# Altium schematic sheet Schematic.SchDoc
size A; SheetNumber: 1; SheetTotal: 1
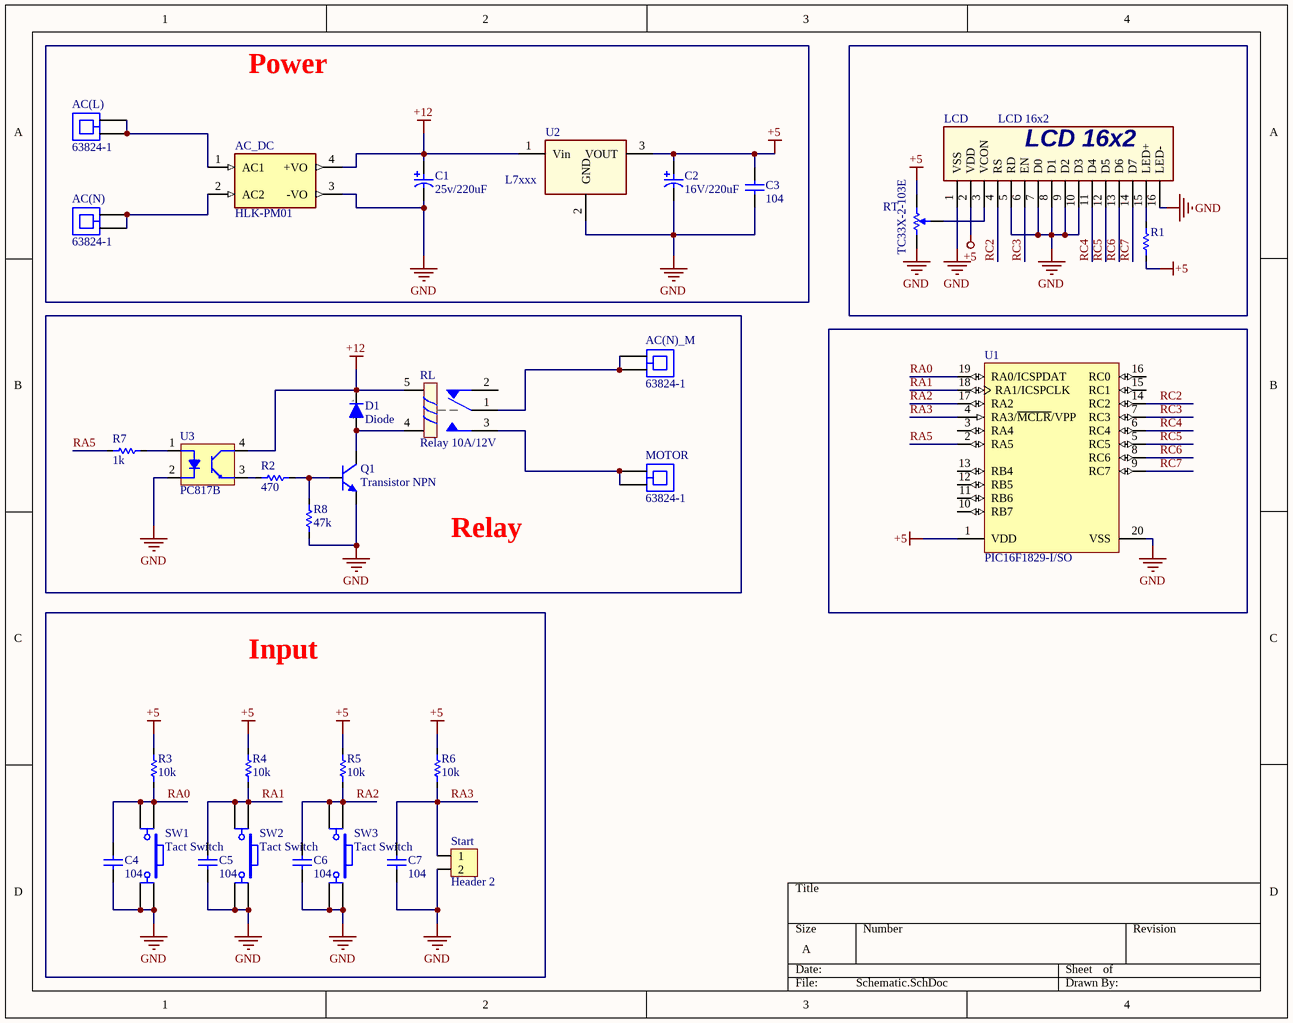
[diagram p0: Schematic.SchDoc]

## Parts
AC(L)  63824-1  [TECO-63824-1_V]
AC(N)  63824-1  [TECO-63824-1_V]
AC(N)_M  63824-1  [TECO-63824-1_V]
AC_DC  HLK-PM01  [CONV_HLK-PM01]
C1  25v/220uF  [C SMD ALU (D8)]
C2  16V/220uF  [C SMD ALU (D8)]
C3  104  [C 0805 (2012)]
C4  104  [C 0805 (2012)]
C5  104  [C 0805 (2012)]
C6  104  [C 0805 (2012)]
C7  104  [C 0805 (2012)]
D1  Diode  [SOD-80]
LCD  LCD 16x2  [LCD 16x2]
MOTOR  63824-1  [TECO-63824-1_V]
Q1  Transistor NPN  [SOT-23]
R1  470  [R 0805 (2012)]  (value not drawn)
R2  470  [R 0805 (2012)]
R3  10k  [R 0805 (2012)]
R4  10k  [R 0805 (2012)]
R5  10k  [R 0805 (2012)]
R6  10k  [R 0805 (2012)]
R7  1k  [R 0805 (2012)]
R8  47k  [R 0805 (2012)]
RL  Relay 10A/12V  [RL_SPDT_10A]
RT  TC33X-2-103E  [BOUR-TC33X-2_V]
Start  Header 2  [XH2.54-2P]
SW1  Tact Switch  [SW/4/DIP 12x12x7]
SW2  Tact Switch  [SW/4/DIP 12x12x7]
SW3  Tact Switch  [SW/4/DIP 12x12x7]
U1  PIC16F1829-I/SO  [MCHP-SOIC-SO20_N]
U2  L7xxx  [TO-252 (DPAK)]
U3  PC817B  [SOIC-4-GULLWING]

## Nets
+5: C2.1 C3.1 LCD.2(VDD) R1.1 R3.2 R4.2 R5.2 R6.2 RT.3 U1.1(VDD) U2.3(VOUT)
+12: AC_DC.4(+VO) C1.1 D1.1(Cathode) RL.5 U2.1(Vin) U3.4(C)
GND: AC_DC.3(-VO) C1.2 C2.2 C3.2 C4.2 C5.2 C6.2 C7.2 LCD.1(VSS) LCD.5(RD) LCD.7(D0) LCD.8(D1) LCD.9(D2) LCD.10(D3) LCD.16(LED-) Q1.2(E) R8.2 RT.1 Start.2 SW1.2 SW1.3 SW2.2 SW2.3 SW3.2 SW3.3 U1.20(VSS) U2.2(GND) U3.2(K)
RA0: C4.1 R3.1 SW1.1 SW1.4 U1.19(RA0/ICSPDAT)
RA1: C5.1 R4.1 SW2.1 SW2.4 U1.18(RA1/ICSPCLK)
RA2: C6.1 R5.1 SW3.1 SW3.4 U1.17(RA2)
RA3: C7.1 R6.1 Start.1 U1.4(RA3/~{MCLR}/VPP)
RA5: R7.2 U1.2(RA5)
RC2: LCD.4(RS) U1.14(RC2)
RC3: LCD.6(EN) U1.7(RC3)
RC4: LCD.11(D4) U1.6(RC4)
RC5: LCD.12(D5) U1.5(RC5)
RC6: LCD.13(D6) U1.8(RC6)
RC7: LCD.14(D7) U1.9(RC7)
NetAC(L)_1: AC(L).1 AC(L).2 AC_DC.1(AC1)
NetAC(N)_1: AC(N).1 AC(N).2 AC_DC.2(AC2)
NetAC(N)_M_1: AC(N)_M.1 AC(N)_M.2 RL.1
NetD1_2: D1.2(Anode) Q1.3(C) RL.4
NetLCD_3: LCD.3(VCON) RT.2
NetLCD_15: LCD.15(LED+) R1.2
NetMOTOR_1: MOTOR.1 MOTOR.2 RL.3
NetQ1_1: Q1.1(B) R2.1 R8.1
NetR2_2: R2.2 U3.3(E)
NetR7_1: R7.1 U3.1(A)

Not connected (* = marked no-connect by the designer): RL 2; U1 3(RA4) 10(RB7) 11(RB6) 12(RB5) 13(RB4) 15(RC1) 16(RC0)

## Notes on the sheet
- Power
- Relay
- Input
- (in symbol Diode) k; a

## Library data of the parts
AC(L) AC(N) AC(N)_M MOTOR = CMP-1684-00002-4: Printed Circuit Board Terminal and Disconnect, 2-Pin THD, RoHS, Tape and Reel; Manufacturer: TE Connectivity; Colour: Silver; Contact Material: Brass; ComponentLink2URL: http://www.te.com/commerce/DocumentDelivery/DDEController?Action=showdoc&DocId=Customer+Drawing%7F63824%7FR%7Fpdf%7FEnglish%7FENG_CD_63824_R_baseFilename.pdf%7F63824-1; ComponentLink1URL: http://www.te.com/; Mounting Technology: Through Hole; Length: 13.63 mm; RoHSCompliant: True; ComponentLink1Description: Manufacturer URL; PackageReference: 63824-1; PackageDescription: 2-Pin Through Hole Device, Body 7.92 x 3.08 mm, Pitch 5.08 mm; Package Quantity: 10000; REACH SVHC: Unknown; ComponentLink2Description: Datasheet; DatasheetVersion: Rev. R, 06/2013; Contact Plating: Tin; Packaging: Tape and Reel
AC_DC = HLK-PM01: The HLK-PM01 is a small size low cost AC to DC converter which can take in 110V/220V AC at 50/60 Hz and give 5V 3W output. The module is can be used in designs which run on 5V and needs to be powered form the AC mains.; MF: Hi-link; Package: None; Value: *; Price: None; Check_prices: https://www.snapeda.com/parts/hlk-pm01/Hi-link/view-part/?ref=eda; MP: hlk-pm01; Availability: Not in stock; SnapEDA_Link: https://www.snapeda.com/parts/hlk-pm01/Hi-link/view-part/?ref=snap
C1 C2 = Capacitor: Capacitor pol
C3-C7 = Capacitor NP: Capacitor non-pol
D1 = Diode: Default Diode; Published: 8-Jun-2000; LatestRevisionDate: 17-Jul-2002; LatestRevisionNote: Re-released for DXP Platform.; PackageVersion: Sep-1996; PackageReference: SMC; Publisher: Altium Limited; Code_JEDEC: DO-214-AB
LCD = LCD 16x2: Character LCD 16x2
Q1 = Transistor NPN: NPN Bipolar Transistor
R1-R8 = Resistor: Published: 8-Jun-2000; LatestRevisionDate: 17-Jul-2002; LatestRevisionNote: Re-released for DXP Platform.; PackageReference: AXIAL-0.3; Publisher: Altium Limited
RL = Relay 1: Relay SPDT,10A - 12VDC 5 Pin; Value: Relay SPDT, 10A, 12V
RT = CMP-2100-03695-1: Trimming Potentiometer, 10000 Ohm, -40 to 100 degC, 3-Pin SMD, RoHS, Tape and Reel; Manufacturer: Bourns; Tolerance: 25%; Max Power Dissipation: 100mW; Number of Turns: 1; Resistance: 10KOhm; Temperature Coefficient: 250ppm/degreesC; Voltage Rating (DC): 50V; Datasheet URL: http://www.bourns.com/docs/Product-Datasheets/TC33.pdf; Composition: Potentiometer; Package Description: 3-Pin Surface Mount Device, Body 3.8 x 3.6 mm; Weight: 29.4mg; Power Rating: 100mW; Termination: FootPrint; Manufacturer URL: http://www.bourns.com/; Width: 0.118inch; Height: 0.047inch; Military Standard: Not; Radiation Hardening: No; Colour: Silver; Case/Package: SMD/SMT; Depth: 3.8mm; Min Operating Temperature: -40degC; Lead Free: LeadFree; Datasheet Version: 42583.0; REACH SVHC: NoSVHC; Length: 3mm; RoHSCompliant: true; Contact Plating: Silver; Taper: Linear; Packaging: TapeandReel; Mount: SurfaceMount; Max Operating Temperature: 100degC; Package Reference: TC33X-2; Package Quantity: 2500
Start = Header 2: Header, 2-Pin; LatestRevisionDate: 17-Jul-2002; LatestRevisionNote: Re-released for DXP Platform.; Publisher: Altium Limited
SW1-SW3 = SW SPST-4: Tact switch 4 pin
U1 = CMP-0115-02414-1: Flash Microcontroller with XLP Technology, 32 MHz, 17 I/O, -40 to 85 degC, 20-pin SOIC (SO20), Tube; Manufacturer: Microchip; Max. CPU Speed MHz: 32; Operation Voltage Range: 1.8V - 5.5V; Timers: 4 - 8-bit, 1 - 16-bit; I/O Pins: 17; Internal Oscillator: 32 MHz, 31 kHz; Program Memory KBytes: 14; EEPROM Data Memory (bytes): 256; Program Memory KWords: 8; Digital Communication: 1 -A/E/USART, 2 -MSSP(SPI/I2C); RAM: 1024; # of A/D Channels: 12; Memory Type: Flash; ComponentLink1Description: Datasheet; PartNumber: PIC16F1829-I/SO; PackageDescription: 20-Lead Plastic Small Outline, 7.5 x 12.8 mm Body, 1.27 mm Pitch; RoHS: TRUE; Mounting Technology: Surface Mount; ComponentLink1URL: http://ww1.microchip.com/downloads/en/DeviceDoc/41440C.pdf; PackageReference: SOIC-SO20; ComponentLink3Description: URL Link1; PackageVersion: C04-094C, 12/2012; ComponentLink2URL: http://www.microchip.com/stellent/groups/techpub_sg/documents/packagingspec/en012702.pdf; DatasheetVersion: Rev. C; ComponentLink3URL: Product URL:http://www.microchip.com/datasheet/PIC16F1829; ComponentLink2Description: Package Specification; Packing: TUBE
U2 = L7xxx: LDO Fixed Voltage regulator
U3 = Opto PC817B